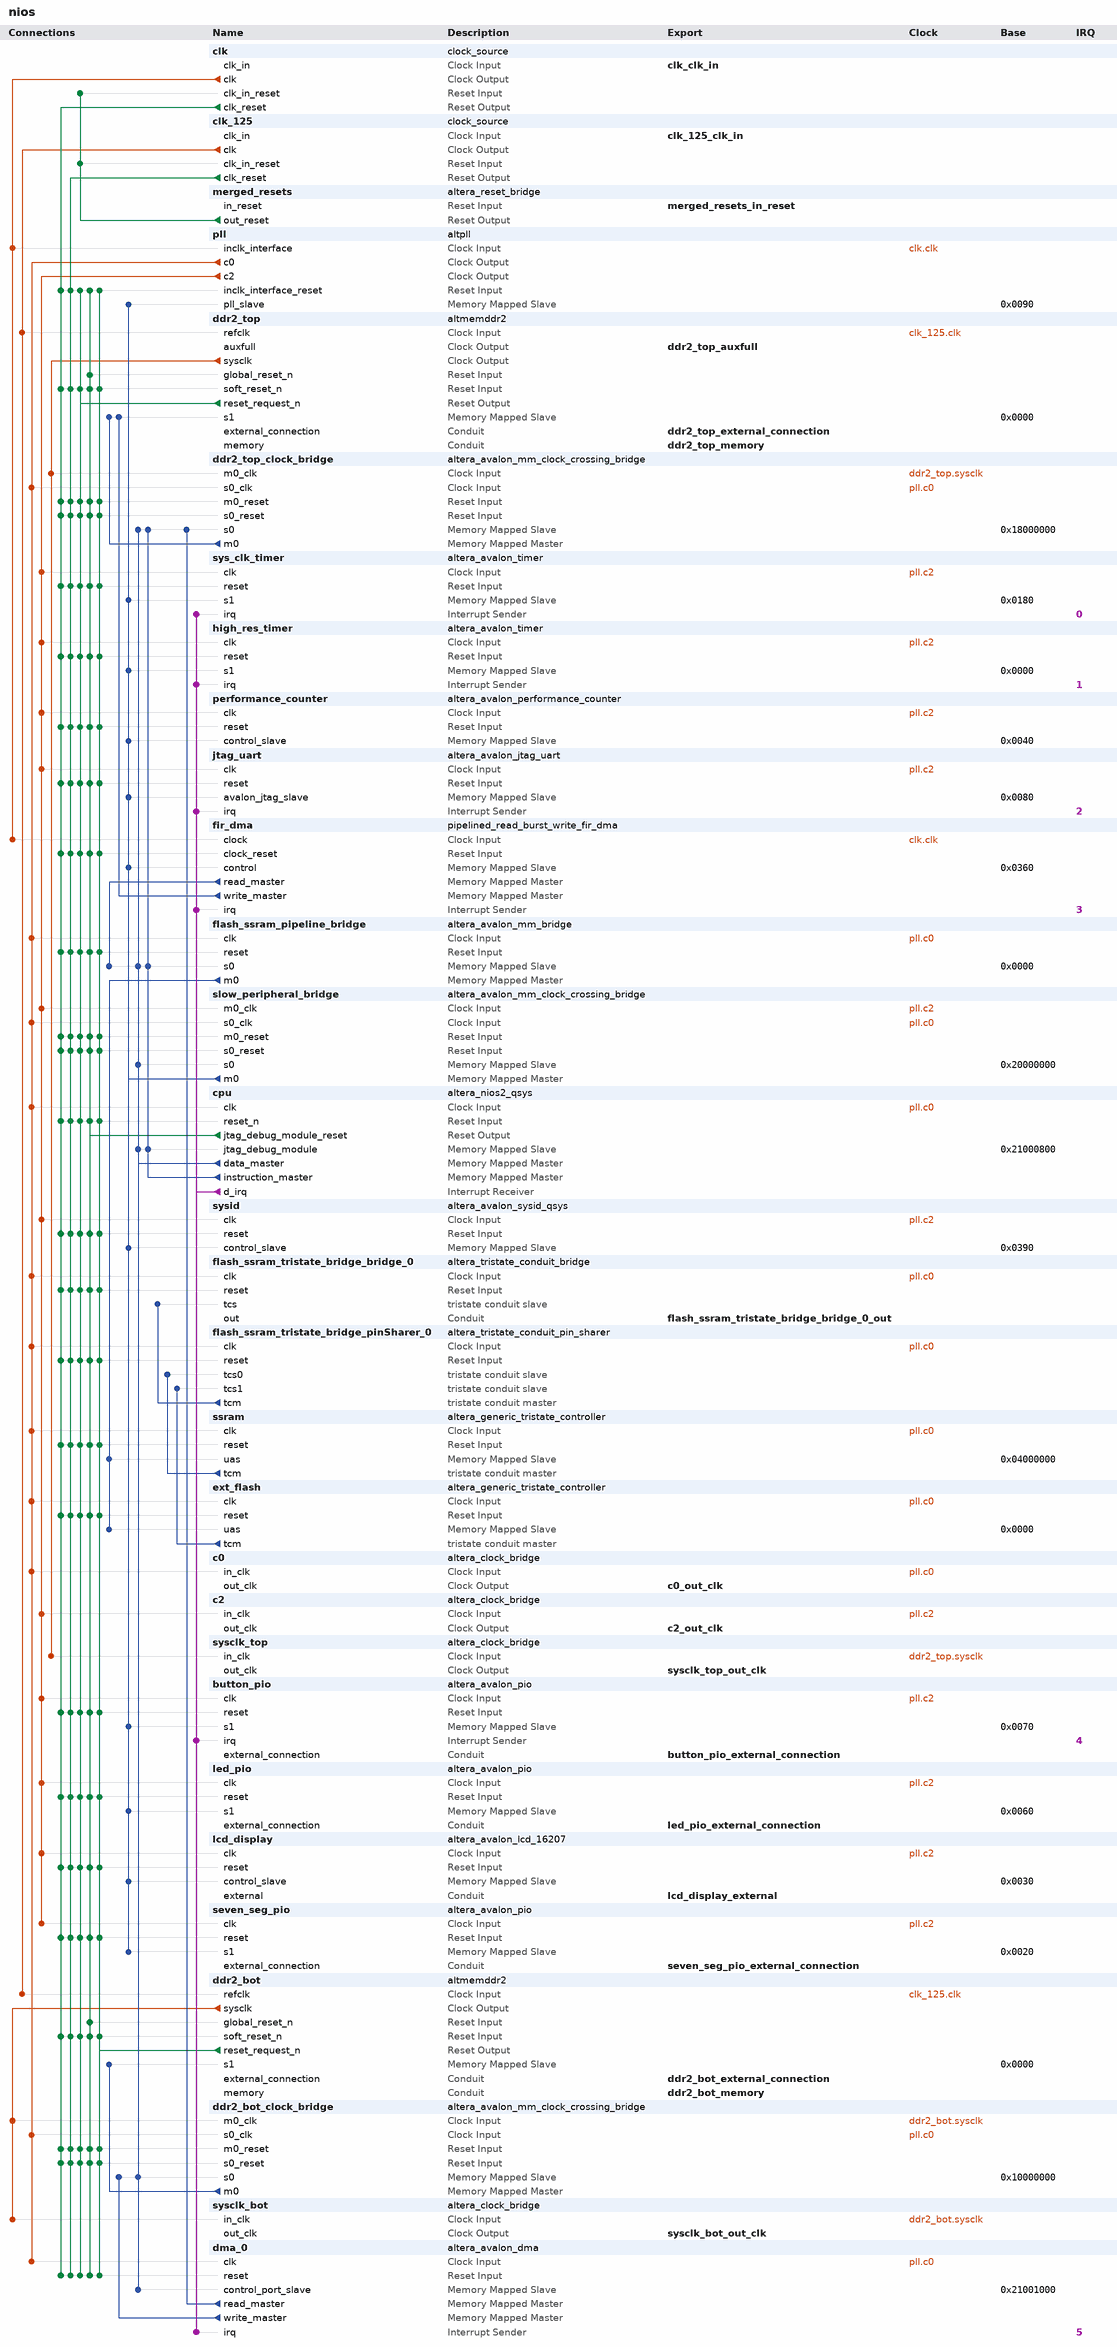
[diagram p0: system contents]
# Platform Designer (Qsys) system nios, Cyclone III EP3C120F780C7
# Parameters at their usual value, and those the tool derives, are not listed.
package require -exact qsys 13.0
create_system nios
set_project_property DEVICE_FAMILY {Cyclone III}
set_project_property DEVICE EP3C120F780C7

add_instance clk clock_source 13.0
set_instance_parameter_value clk clockFrequency 50000000

add_instance clk_125 clock_source 13.0
set_instance_parameter_value clk_125 clockFrequency 125000000

add_instance merged_resets altera_reset_bridge 13.0
set_instance_parameter_value merged_resets ACTIVE_LOW_RESET 1
set_instance_parameter_value merged_resets SYNCHRONOUS_EDGES none

add_instance pll altpll 13.0
set_instance_parameter_value pll INCLK0_INPUT_FREQUENCY 20000
set_instance_parameter_value pll CLK0_MULTIPLY_BY 2
set_instance_parameter_value pll CLK2_MULTIPLY_BY 6
set_instance_parameter_value pll CLK0_DIVIDE_BY 1
set_instance_parameter_value pll CLK2_DIVIDE_BY 5
set_instance_parameter_value pll CLK2_PHASE_SHIFT 0
set_instance_parameter_value pll CLK2_DUTY_CYCLE 50
set_instance_parameter_value pll PORT_clk1 PORT_UNUSED
set_instance_parameter_value pll PORT_clk2 PORT_USED
set_instance_parameter_value pll PORT_clk3 PORT_UNUSED
set_instance_parameter_value pll PORT_ARESET PORT_UNUSED
set_instance_parameter_value pll PORT_LOCKED PORT_UNUSED

add_instance ddr2_top altmemddr2 13.0
set_instance_parameter_value ddr2_top pipeline_commands false
set_instance_parameter_value ddr2_top debug_en false
set_instance_parameter_value ddr2_top export_debug_port false
set_instance_parameter_value ddr2_top use_generated_memory_model true
set_instance_parameter_value ddr2_top dedicated_memory_clk_phase_label {Dedicated memory clock phase:}
set_instance_parameter_value ddr2_top mem_if_clk_mhz 153.85
set_instance_parameter_value ddr2_top quartus_project_exists false
set_instance_parameter_value ddr2_top local_if_drate Full
set_instance_parameter_value ddr2_top enable_v72_rsu false
set_instance_parameter_value ddr2_top local_if_clk_mhz_label 153.9
set_instance_parameter_value ddr2_top new_variant true
set_instance_parameter_value ddr2_top mem_if_memtype {DDR2 SDRAM}
set_instance_parameter_value ddr2_top pll_ref_clk_mhz 125.0
set_instance_parameter_value ddr2_top mem_if_clk_ps_label {(6500 ps)}
set_instance_parameter_value ddr2_top family {Cyclone III}
set_instance_parameter_value ddr2_top project_family {Cyclone III}
set_instance_parameter_value ddr2_top speed_grade 7
set_instance_parameter_value ddr2_top dedicated_memory_clk_phase 0
set_instance_parameter_value ddr2_top pll_ref_clk_ps_label {(8000 ps)}
set_instance_parameter_value ddr2_top avalon_burst_length 1
set_instance_parameter_value ddr2_top mem_if_clk_pair_count 1
set_instance_parameter_value ddr2_top mem_if_cs_per_dimm 1
set_instance_parameter_value ddr2_top pre_latency_label {Fix read latency at:}
set_instance_parameter_value ddr2_top dedicated_memory_clk_en false
set_instance_parameter_value ddr2_top mirror_addressing 0
set_instance_parameter_value ddr2_top mem_if_bankaddr_width 2
set_instance_parameter_value ddr2_top register_control_word_9 0000
set_instance_parameter_value ddr2_top mem_if_rowaddr_width 13
set_instance_parameter_value ddr2_top mem_dyn_deskew_en false
set_instance_parameter_value ddr2_top post_latency_label {cycles (0 cycles=minimum latency, non-deterministic)}
set_instance_parameter_value ddr2_top mem_if_dm_pins_en Yes
set_instance_parameter_value ddr2_top local_if_dwidth_label 64
set_instance_parameter_value ddr2_top register_control_word_7 0000
set_instance_parameter_value ddr2_top register_control_word_8 0000
set_instance_parameter_value ddr2_top mem_if_preset {Micron MT47H32M16CC-3x2}
set_instance_parameter_value ddr2_top mem_if_pchaddr_bit 10
set_instance_parameter_value ddr2_top WIDTH_RATIO 4
set_instance_parameter_value ddr2_top vendor Micron
set_instance_parameter_value ddr2_top register_control_word_3 0000
set_instance_parameter_value ddr2_top register_control_word_4 0000
set_instance_parameter_value ddr2_top chip_or_dimm {Discrete Device}
set_instance_parameter_value ddr2_top register_control_word_5 0000
set_instance_parameter_value ddr2_top register_control_word_6 0000
set_instance_parameter_value ddr2_top mem_fmax 333.333
set_instance_parameter_value ddr2_top register_control_word_0 0000
set_instance_parameter_value ddr2_top register_control_word_size 4
set_instance_parameter_value ddr2_top register_control_word_1 0000
set_instance_parameter_value ddr2_top register_control_word_2 0000
set_instance_parameter_value ddr2_top register_control_word_11 0000
set_instance_parameter_value ddr2_top register_control_word_10 0000
set_instance_parameter_value ddr2_top mem_if_cs_width 1
set_instance_parameter_value ddr2_top mem_if_preset_rlat 0
set_instance_parameter_value ddr2_top mem_if_cs_per_rank 1
set_instance_parameter_value ddr2_top fast_simulation_en FAST
set_instance_parameter_value ddr2_top register_control_word_15 0000
set_instance_parameter_value ddr2_top register_control_word_14 0000
set_instance_parameter_value ddr2_top mem_if_dwidth 32
set_instance_parameter_value ddr2_top mem_if_dq_per_dqs 8
set_instance_parameter_value ddr2_top mem_if_coladdr_width 10
set_instance_parameter_value ddr2_top register_control_word_13 0000
set_instance_parameter_value ddr2_top register_control_word_12 0000
set_instance_parameter_value ddr2_top mem_tiha_ps 400
set_instance_parameter_value ddr2_top mem_tdsh_ck 0.2
set_instance_parameter_value ddr2_top mem_if_trfc_ns 105.0
set_instance_parameter_value ddr2_top mem_tqh_ck 0.36
set_instance_parameter_value ddr2_top mem_tisa_ps 400
set_instance_parameter_value ddr2_top mem_tdss_ck 0.2
set_instance_parameter_value ddr2_top mem_trtp_ns 7.5
set_instance_parameter_value ddr2_top mem_if_tinit_us 200.0
set_instance_parameter_value ddr2_top mem_if_trcd_ns 15.0
set_instance_parameter_value ddr2_top mem_if_twtr_ck 3
set_instance_parameter_value ddr2_top mem_trrd_ns 10.0
set_instance_parameter_value ddr2_top mem_tdqss_ck 0.25
set_instance_parameter_value ddr2_top mem_tqhs_ps 340
set_instance_parameter_value ddr2_top mem_tdsa_ps 300
set_instance_parameter_value ddr2_top mem_tac_ps 450
set_instance_parameter_value ddr2_top mem_tdha_ps 300
set_instance_parameter_value ddr2_top mem_if_tras_ns 40.0
set_instance_parameter_value ddr2_top mem_if_twr_ns 15.0
set_instance_parameter_value ddr2_top mem_tdqsck_ps 400
set_instance_parameter_value ddr2_top mem_if_trp_ns 15.0
set_instance_parameter_value ddr2_top mem_tdqsq_ps 240
set_instance_parameter_value ddr2_top mem_if_tmrd_ns 6.0
set_instance_parameter_value ddr2_top mem_tfaw_ns 50.0
set_instance_parameter_value ddr2_top mem_if_trefi_us 7.8
set_instance_parameter_value ddr2_top mem_tcl_40_fmax 266.667
set_instance_parameter_value ddr2_top mem_odt 50
set_instance_parameter_value ddr2_top mp_WLH_percent 0.6
set_instance_parameter_value ddr2_top mem_drv_str Normal
set_instance_parameter_value ddr2_top mp_DH_percent 0.5
set_instance_parameter_value ddr2_top input_period 0
set_instance_parameter_value ddr2_top mp_QH_percent 0.5
set_instance_parameter_value ddr2_top mp_QHS_percent 0.5
set_instance_parameter_value ddr2_top mem_tcl_30_fmax 200.0
set_instance_parameter_value ddr2_top ac_clk_select 90
set_instance_parameter_value ddr2_top mp_DQSQ_percent 0.65
set_instance_parameter_value ddr2_top mp_DS_percent 0.6
set_instance_parameter_value ddr2_top pll_reconfig_ports_en false
set_instance_parameter_value ddr2_top mem_btype Sequential
set_instance_parameter_value ddr2_top mp_IS_percent 0.7
set_instance_parameter_value ddr2_top mem_tcl 5.0
set_instance_parameter_value ddr2_top mp_DQSS_percent 0.5
set_instance_parameter_value ddr2_top export_bank_info false
set_instance_parameter_value ddr2_top mp_DSS_percent 0.6
set_instance_parameter_value ddr2_top mem_dll_en Yes
set_instance_parameter_value ddr2_top ac_phase 90
set_instance_parameter_value ddr2_top mem_if_oct_en false
set_instance_parameter_value ddr2_top mem_tcl_60_fmax 333.333
set_instance_parameter_value ddr2_top mp_DSH_percent 0.6
set_instance_parameter_value ddr2_top mem_if_dqsn_en false
set_instance_parameter_value ddr2_top enable_mp_calibration true
set_instance_parameter_value ddr2_top mp_IH_percent 0.6
set_instance_parameter_value ddr2_top mem_tcl_15_fmax 533.0
set_instance_parameter_value ddr2_top dll_external false
set_instance_parameter_value ddr2_top mem_bl 4
set_instance_parameter_value ddr2_top mp_WLS_percent 0.7
set_instance_parameter_value ddr2_top mem_tcl_50_fmax 333.333
set_instance_parameter_value ddr2_top mp_DQSCK_percent 0.5
set_instance_parameter_value ddr2_top mem_tcl_25_fmax 533.0
set_instance_parameter_value ddr2_top mem_tcl_20_fmax 533.0
set_instance_parameter_value ddr2_top cfg_reorder_data true
set_instance_parameter_value ddr2_top ctl_ecc_en false
set_instance_parameter_value ddr2_top ctl_hrb_en false
set_instance_parameter_value ddr2_top ref_clk_source clk_125
set_instance_parameter_value ddr2_top cfg_data_reordering_type INTER_BANK
set_instance_parameter_value ddr2_top ctl_powerdn_en false
set_instance_parameter_value ddr2_top multicast_wr_en false
set_instance_parameter_value ddr2_top auto_powerdn_cycles 0
set_instance_parameter_value ddr2_top ctl_self_refresh_en false
set_instance_parameter_value ddr2_top cfg_starve_limit 10
set_instance_parameter_value ddr2_top ctl_latency 0
set_instance_parameter_value ddr2_top tool_context SOPC_BUILDER
set_instance_parameter_value ddr2_top mem_addr_mapping CHIP_ROW_BANK_COL
set_instance_parameter_value ddr2_top burst_merge_en false
set_instance_parameter_value ddr2_top user_refresh_en false
set_instance_parameter_value ddr2_top qsys_mode true
set_instance_parameter_value ddr2_top clk_source_sharing_en false
set_instance_parameter_value ddr2_top ctl_lookahead_depth 4
set_instance_parameter_value ddr2_top ctl_autopch_en false
set_instance_parameter_value ddr2_top ctl_dynamic_bank_allocation false
set_instance_parameter_value ddr2_top ctl_dynamic_bank_num 4
set_instance_parameter_value ddr2_top local_if_type_avalon true
set_instance_parameter_value ddr2_top csr_en false
set_instance_parameter_value ddr2_top ctl_auto_correct_en false
set_instance_parameter_value ddr2_top auto_powerdn_en false
set_instance_parameter_value ddr2_top phy_if_type_afi true
set_instance_parameter_value ddr2_top controller_type ngv110_ctl
set_instance_parameter_value ddr2_top max_local_size 4
set_instance_parameter_value ddr2_top mem_srtr Normal
set_instance_parameter_value ddr2_top mem_mpr_loc {Predefined Pattern}
set_instance_parameter_value ddr2_top dss_tinit_rst_us 200.0
set_instance_parameter_value ddr2_top mem_tcl_90_fmax 400.0
set_instance_parameter_value ddr2_top mem_rtt_wr {Dynamic ODT off}
set_instance_parameter_value ddr2_top mem_tcl_100_fmax 400.0
set_instance_parameter_value ddr2_top mem_pasr {Full Array}
set_instance_parameter_value ddr2_top mem_asrm {Manual SR Reference (SRT)}
set_instance_parameter_value ddr2_top mem_mpr_oper {Predefined Pattern}
set_instance_parameter_value ddr2_top mem_tcl_80_fmax 400.0
set_instance_parameter_value ddr2_top mem_drv_impedance RZQ/7
set_instance_parameter_value ddr2_top mem_rtt_nom {ODT Disabled}
set_instance_parameter_value ddr2_top mem_tcl_70_fmax 400.0
set_instance_parameter_value ddr2_top mem_wtcl 5.0
set_instance_parameter_value ddr2_top mem_dll_pch {Fast Exit}
set_instance_parameter_value ddr2_top mem_atcl Disabled
set_instance_parameter_value ddr2_top board_settings_valid true
set_instance_parameter_value ddr2_top t_IH 0.4
set_instance_parameter_value ddr2_top board_intra_DQS_group_skew 0.02
set_instance_parameter_value ddr2_top isi_DQS 0.0
set_instance_parameter_value ddr2_top addr_cmd_slew_rate 1.0
set_instance_parameter_value ddr2_top board_tpd_inter_DIMM 0.05
set_instance_parameter_value ddr2_top board_addresscmd_CK_skew 0.0
set_instance_parameter_value ddr2_top t_DS_calculated 0.300
set_instance_parameter_value ddr2_top isi_addresscmd_hold 0.0
set_instance_parameter_value ddr2_top t_IS 0.4
set_instance_parameter_value ddr2_top restore_default_toggle false
set_instance_parameter_value ddr2_top dqs_dqsn_slew_rate 2.0
set_instance_parameter_value ddr2_top dq_slew_rate 1.0
set_instance_parameter_value ddr2_top board_inter_DQS_group_skew 0.02
set_instance_parameter_value ddr2_top isi_addresscmd_setup 0.0
set_instance_parameter_value ddr2_top board_minCK_DQS_skew -0.01
set_instance_parameter_value ddr2_top t_IS_calculated 0.400
set_instance_parameter_value ddr2_top num_slots_or_devices 1
set_instance_parameter_value ddr2_top board_maxCK_DQS_skew 0.01
set_instance_parameter_value ddr2_top board_skew_ps 20
set_instance_parameter_value ddr2_top t_DH 0.3
set_instance_parameter_value ddr2_top ck_ckn_slew_rate 2.0
set_instance_parameter_value ddr2_top isi_DQ 0.0
set_instance_parameter_value ddr2_top t_IH_calculated 0.400
set_instance_parameter_value ddr2_top t_DH_calculated 0.300
set_instance_parameter_value ddr2_top t_DS 0.3

add_instance ddr2_top_clock_bridge altera_avalon_mm_clock_crossing_bridge 13.0
set_instance_parameter_value ddr2_top_clock_bridge DATA_WIDTH 64
set_instance_parameter_value ddr2_top_clock_bridge ADDRESS_WIDTH 27
set_instance_parameter_value ddr2_top_clock_bridge MAX_BURST_SIZE 1
set_instance_parameter_value ddr2_top_clock_bridge COMMAND_FIFO_DEPTH 8
set_instance_parameter_value ddr2_top_clock_bridge RESPONSE_FIFO_DEPTH 64
set_instance_parameter_value ddr2_top_clock_bridge MASTER_SYNC_DEPTH 3
set_instance_parameter_value ddr2_top_clock_bridge SLAVE_SYNC_DEPTH 3

add_instance sys_clk_timer altera_avalon_timer 13.0.1
set_instance_parameter_value sys_clk_timer period 10.0
set_instance_parameter_value sys_clk_timer periodUnits MSEC

add_instance high_res_timer altera_avalon_timer 13.0.1
set_instance_parameter_value high_res_timer period 10.0
set_instance_parameter_value high_res_timer periodUnits USEC

add_instance performance_counter altera_avalon_performance_counter 13.0.1
set_instance_parameter_value performance_counter numberOfSections 1

add_instance jtag_uart altera_avalon_jtag_uart 13.0.1
set_instance_parameter_value jtag_uart readBufferDepth 8
set_instance_parameter_value jtag_uart readIRQThreshold 4
set_instance_parameter_value jtag_uart simInteractiveOptions INTERACTIVE_ASCII_OUTPUT
set_instance_parameter_value jtag_uart useRegistersForReadBuffer true
set_instance_parameter_value jtag_uart useRegistersForWriteBuffer true
set_instance_parameter_value jtag_uart writeBufferDepth 8
set_instance_parameter_value jtag_uart writeIRQThreshold 4

add_instance fir_dma pipelined_read_burst_write_fir_dma 1.0
set_instance_parameter_value fir_dma DATAWIDTH 32
set_instance_parameter_value fir_dma BYTEENABLEWIDTH 4
set_instance_parameter_value fir_dma ADDRESSWIDTH 32
set_instance_parameter_value fir_dma FIFOUSEMEMORY 1
set_instance_parameter_value fir_dma READ_FIFODEPTH 32
set_instance_parameter_value fir_dma READ_FIFODEPTH_LOG2 5
set_instance_parameter_value fir_dma WRITE_FIFODEPTH 32
set_instance_parameter_value fir_dma WRITE_FIFODEPTH_LOG2 5
set_instance_parameter_value fir_dma WRITE_MAXBURSTCOUNT 4
set_instance_parameter_value fir_dma WRITE_MAXBURSTCOUNT_WIDTH 3

add_instance flash_ssram_pipeline_bridge altera_avalon_mm_bridge 13.0
set_instance_parameter_value flash_ssram_pipeline_bridge DATA_WIDTH 32
set_instance_parameter_value flash_ssram_pipeline_bridge ADDRESS_WIDTH 27
set_instance_parameter_value flash_ssram_pipeline_bridge ADDRESS_UNITS SYMBOLS
set_instance_parameter_value flash_ssram_pipeline_bridge MAX_PENDING_RESPONSES 7

add_instance slow_peripheral_bridge altera_avalon_mm_clock_crossing_bridge 13.0
set_instance_parameter_value slow_peripheral_bridge DATA_WIDTH 32
set_instance_parameter_value slow_peripheral_bridge ADDRESS_WIDTH 10
set_instance_parameter_value slow_peripheral_bridge MAX_BURST_SIZE 1
set_instance_parameter_value slow_peripheral_bridge COMMAND_FIFO_DEPTH 16
set_instance_parameter_value slow_peripheral_bridge RESPONSE_FIFO_DEPTH 64
set_instance_parameter_value slow_peripheral_bridge MASTER_SYNC_DEPTH 3
set_instance_parameter_value slow_peripheral_bridge SLAVE_SYNC_DEPTH 3

add_instance cpu altera_nios2_qsys 13.0
set_instance_parameter_value cpu cpuID 1
set_instance_parameter_value cpu resetSlave ddr2_top.s1
set_instance_parameter_value cpu mmu_TLBMissExcSlave None
set_instance_parameter_value cpu exceptionSlave ddr2_top.s1
set_instance_parameter_value cpu breakSlave cpu.jtag_debug_module
set_instance_parameter_value cpu impl Fast
set_instance_parameter_value cpu icache_size 32768
set_instance_parameter_value cpu dcache_size 32768

add_instance sysid altera_avalon_sysid_qsys 13.0
set_instance_parameter_value sysid id 2

add_instance flash_ssram_tristate_bridge_bridge_0 altera_tristate_conduit_bridge 13.0

add_instance flash_ssram_tristate_bridge_pinSharer_0 altera_tristate_conduit_pin_sharer 13.0
set_instance_parameter_value flash_ssram_tristate_bridge_pinSharer_0 NUM_INTERFACES 2
set_instance_parameter_value flash_ssram_tristate_bridge_pinSharer_0 MODULE_ORIGIN_LIST ext_flash.tcm,ext_flash.tcm,ext_flash.tcm,ext_flash.tcm,ext_flash.tcm,ssram.tcm,ssram.tcm,ssram.tcm,ssram.tcm,ssram.tcm,ssram.tcm
set_instance_parameter_value flash_ssram_tristate_bridge_pinSharer_0 SIGNAL_ORIGIN_LIST address,read_n,write_n,data,chipselect_n,address,byteenable_n,read_n,write_n,data,chipselect_n
set_instance_parameter_value flash_ssram_tristate_bridge_pinSharer_0 SHARED_SIGNAL_LIST flash_ssram_tristate_bridge_address,read_n_to_the_ext_flash,write_n_to_the_ext_flash,flash_ssram_tristate_bridge_data,select_n_to_the_ext_flash,address_to_the_ssram,bw_n_to_the_ssram,,bwe_n_to_the_ssram,flash_ssram_tristate_bridge_data,chipenable1_n_to_the_ssram

add_instance ssram altera_generic_tristate_controller 13.0
set_instance_parameter_value ssram TCM_ADDRESS_W 23
set_instance_parameter_value ssram TCM_DATA_W 32
set_instance_parameter_value ssram TCM_BYTEENABLE_W 4
set_instance_parameter_value ssram TCM_READ_WAIT 200
set_instance_parameter_value ssram TCM_WRITE_WAIT 200
set_instance_parameter_value ssram TCM_SETUP_WAIT 200
set_instance_parameter_value ssram TCM_DATA_HOLD 200
set_instance_parameter_value ssram TCM_MAX_PENDING_READ_TRANSACTIONS 5
set_instance_parameter_value ssram TCM_TURNAROUND_TIME 2
set_instance_parameter_value ssram TCM_TIMING_UNITS 0
set_instance_parameter_value ssram TCM_READLATENCY 4
set_instance_parameter_value ssram TCM_SYMBOLS_PER_WORD 4
set_instance_parameter_value ssram USE_READ 1
set_instance_parameter_value ssram USE_BEGINTRANSFER 0
set_instance_parameter_value ssram USE_BYTEENABLE 1
set_instance_parameter_value ssram USE_OUTPUTENABLE 0
set_instance_parameter_value ssram ACTIVE_LOW_READ 1
set_instance_parameter_value ssram ACTIVE_LOW_BYTEENABLE 1
set_instance_parameter_value ssram ACTIVE_LOW_OUTPUTENABLE 0
set_instance_parameter_value ssram ACTIVE_LOW_BEGINTRANSFER 0
set_instance_parameter_value ssram CHIPSELECT_THROUGH_READLATENCY 0
set_instance_parameter_value ssram MODULE_ASSIGNMENT_KEYS embeddedsw.configuration.hwClassnameDriverSupportList,embeddedsw.CMacro.SRAM_MEMORY_SIZE,embeddedsw.CMacro.SRAM_MEMORY_UNITS,embeddedsw.CMacro.SSRAM_DATA_WIDTH,embeddedsw.CMacro.SSRAM_READ_LATENCY,embeddedsw.memoryInfo.MEM_INIT_DATA_WIDTH,embeddedsw.memoryInfo.HAS_BYTE_LANE,embeddedsw.memoryInfo.GENERATE_DAT_SYM,embeddedsw.memoryInfo.DAT_SYM_INSTALL_DIR
set_instance_parameter_value ssram MODULE_ASSIGNMENT_VALUES altera_avalon_lan91c111:altera_avalon_cfi_flash,1,1048576,32,2,32,1,1,SIM_DIR
set_instance_parameter_value ssram INTERFACE_ASSIGNMENT_KEYS embeddedsw.configuration.isMemoryDevice
set_instance_parameter_value ssram INTERFACE_ASSIGNMENT_VALUES 1

add_instance ext_flash altera_generic_tristate_controller 13.0
set_instance_parameter_value ext_flash TCM_ADDRESS_W 26
set_instance_parameter_value ext_flash TCM_DATA_W 16
set_instance_parameter_value ext_flash TCM_BYTEENABLE_W 2
set_instance_parameter_value ext_flash TCM_READ_WAIT 40
set_instance_parameter_value ext_flash TCM_WRITE_WAIT 40
set_instance_parameter_value ext_flash TCM_SETUP_WAIT 80
set_instance_parameter_value ext_flash TCM_DATA_HOLD 20
set_instance_parameter_value ext_flash TCM_MAX_PENDING_READ_TRANSACTIONS 3
set_instance_parameter_value ext_flash TCM_TURNAROUND_TIME 2
set_instance_parameter_value ext_flash TCM_TIMING_UNITS 0
set_instance_parameter_value ext_flash TCM_READLATENCY 2
set_instance_parameter_value ext_flash TCM_SYMBOLS_PER_WORD 2
set_instance_parameter_value ext_flash USE_READ 1
set_instance_parameter_value ext_flash USE_BEGINTRANSFER 0
set_instance_parameter_value ext_flash USE_BYTEENABLE 0
set_instance_parameter_value ext_flash USE_OUTPUTENABLE 0
set_instance_parameter_value ext_flash ACTIVE_LOW_READ 1
set_instance_parameter_value ext_flash ACTIVE_LOW_BYTEENABLE 0
set_instance_parameter_value ext_flash ACTIVE_LOW_OUTPUTENABLE 0
set_instance_parameter_value ext_flash ACTIVE_LOW_BEGINTRANSFER 0
set_instance_parameter_value ext_flash CHIPSELECT_THROUGH_READLATENCY 0
set_instance_parameter_value ext_flash MODULE_ASSIGNMENT_KEYS embeddedsw.configuration.hwClassnameDriverSupportList,embeddedsw.configuration.hwClassnameDriverSupportDefault,embeddedsw.CMacro.SETUP_VALUE,embeddedsw.CMacro.WAIT_VALUE,embeddedsw.CMacro.HOLD_VALUE,embeddedsw.CMacro.TIMING_UNITS,embeddedsw.CMacro.SIZE,embeddedsw.memoryInfo.MEM_INIT_DATA_WIDTH,embeddedsw.memoryInfo.HAS_BYTE_LANE,embeddedsw.memoryInfo.IS_FLASH,embeddedsw.memoryInfo.GENERATE_DAT_SYM,embeddedsw.memoryInfo.GENERATE_FLASH,embeddedsw.memoryInfo.DAT_SYM_INSTALL_DIR,embeddedsw.memoryInfo.FLASH_INSTALL_DIR
set_instance_parameter_value ext_flash MODULE_ASSIGNMENT_VALUES {altera_avalon_lan91c111:altera_avalon_cfi_flash,altera_avalon_cfi_flash,80,40,20,"ns",67108864u,16,1,1,1,1,SIM_DIR,APP_DIR}
set_instance_parameter_value ext_flash INTERFACE_ASSIGNMENT_KEYS embeddedsw.configuration.isFlash,embeddedsw.configuration.isMemoryDevice,embeddedsw.configuration.isNonVolatileStorage
set_instance_parameter_value ext_flash INTERFACE_ASSIGNMENT_VALUES 1,1,1

add_instance c0 altera_clock_bridge 13.0
set_instance_parameter_value c0 DERIVED_CLOCK_RATE 100000000
set_instance_parameter_value c0 EXPLICIT_CLOCK_RATE 0

add_instance c2 altera_clock_bridge 13.0
set_instance_parameter_value c2 DERIVED_CLOCK_RATE 60000000
set_instance_parameter_value c2 EXPLICIT_CLOCK_RATE 0

add_instance sysclk_top altera_clock_bridge 13.0
set_instance_parameter_value sysclk_top DERIVED_CLOCK_RATE 153850000
set_instance_parameter_value sysclk_top EXPLICIT_CLOCK_RATE 0

add_instance button_pio altera_avalon_pio 13.0.1
set_instance_parameter_value button_pio captureEdge true
set_instance_parameter_value button_pio direction Input
set_instance_parameter_value button_pio generateIRQ true
set_instance_parameter_value button_pio irqType EDGE
set_instance_parameter_value button_pio simDoTestBenchWiring true
set_instance_parameter_value button_pio simDrivenValue 15
set_instance_parameter_value button_pio width 4

add_instance led_pio altera_avalon_pio 13.0.1
set_instance_parameter_value led_pio direction Output
set_instance_parameter_value led_pio width 8

add_instance lcd_display altera_avalon_lcd_16207 13.0.1

add_instance seven_seg_pio altera_avalon_pio 13.0.1
set_instance_parameter_value seven_seg_pio direction Output
set_instance_parameter_value seven_seg_pio width 16

add_instance ddr2_bot altmemddr2 13.0
set_instance_parameter_value ddr2_bot pipeline_commands false
set_instance_parameter_value ddr2_bot debug_en false
set_instance_parameter_value ddr2_bot export_debug_port false
set_instance_parameter_value ddr2_bot use_generated_memory_model true
set_instance_parameter_value ddr2_bot dedicated_memory_clk_phase_label {Dedicated memory clock phase:}
set_instance_parameter_value ddr2_bot mem_if_clk_mhz 153.85
set_instance_parameter_value ddr2_bot quartus_project_exists false
set_instance_parameter_value ddr2_bot local_if_drate Full
set_instance_parameter_value ddr2_bot enable_v72_rsu false
set_instance_parameter_value ddr2_bot local_if_clk_mhz_label 153.9
set_instance_parameter_value ddr2_bot new_variant true
set_instance_parameter_value ddr2_bot mem_if_memtype {DDR2 SDRAM}
set_instance_parameter_value ddr2_bot pll_ref_clk_mhz 125.0
set_instance_parameter_value ddr2_bot mem_if_clk_ps_label {(6500 ps)}
set_instance_parameter_value ddr2_bot family {Cyclone III}
set_instance_parameter_value ddr2_bot project_family {Cyclone III}
set_instance_parameter_value ddr2_bot speed_grade 7
set_instance_parameter_value ddr2_bot dedicated_memory_clk_phase 0
set_instance_parameter_value ddr2_bot pll_ref_clk_ps_label {(8000 ps)}
set_instance_parameter_value ddr2_bot avalon_burst_length 1
set_instance_parameter_value ddr2_bot mem_if_clk_pair_count 1
set_instance_parameter_value ddr2_bot mem_if_cs_per_dimm 1
set_instance_parameter_value ddr2_bot pre_latency_label {Fix read latency at:}
set_instance_parameter_value ddr2_bot dedicated_memory_clk_en false
set_instance_parameter_value ddr2_bot mirror_addressing 0
set_instance_parameter_value ddr2_bot mem_if_bankaddr_width 2
set_instance_parameter_value ddr2_bot register_control_word_9 0000
set_instance_parameter_value ddr2_bot mem_if_rowaddr_width 13
set_instance_parameter_value ddr2_bot mem_dyn_deskew_en false
set_instance_parameter_value ddr2_bot post_latency_label {cycles (0 cycles=minimum latency, non-deterministic)}
set_instance_parameter_value ddr2_bot mem_if_dm_pins_en Yes
set_instance_parameter_value ddr2_bot local_if_dwidth_label 64
set_instance_parameter_value ddr2_bot register_control_word_7 0000
set_instance_parameter_value ddr2_bot register_control_word_8 0000
set_instance_parameter_value ddr2_bot mem_if_preset {Micron MT47H32M16CC-3x2}
set_instance_parameter_value ddr2_bot mem_if_pchaddr_bit 10
set_instance_parameter_value ddr2_bot WIDTH_RATIO 4
set_instance_parameter_value ddr2_bot vendor Micron
set_instance_parameter_value ddr2_bot register_control_word_3 0000
set_instance_parameter_value ddr2_bot register_control_word_4 0000
set_instance_parameter_value ddr2_bot chip_or_dimm {Discrete Device}
set_instance_parameter_value ddr2_bot register_control_word_5 0000
set_instance_parameter_value ddr2_bot register_control_word_6 0000
set_instance_parameter_value ddr2_bot mem_fmax 333.333
set_instance_parameter_value ddr2_bot register_control_word_0 0000
set_instance_parameter_value ddr2_bot register_control_word_size 4
set_instance_parameter_value ddr2_bot register_control_word_1 0000
set_instance_parameter_value ddr2_bot register_control_word_2 0000
set_instance_parameter_value ddr2_bot register_control_word_11 0000
set_instance_parameter_value ddr2_bot register_control_word_10 0000
set_instance_parameter_value ddr2_bot mem_if_cs_width 1
set_instance_parameter_value ddr2_bot mem_if_preset_rlat 0
set_instance_parameter_value ddr2_bot mem_if_cs_per_rank 1
set_instance_parameter_value ddr2_bot fast_simulation_en FAST
set_instance_parameter_value ddr2_bot register_control_word_15 0000
set_instance_parameter_value ddr2_bot register_control_word_14 0000
set_instance_parameter_value ddr2_bot mem_if_dwidth 32
set_instance_parameter_value ddr2_bot mem_if_dq_per_dqs 8
set_instance_parameter_value ddr2_bot mem_if_coladdr_width 10
set_instance_parameter_value ddr2_bot register_control_word_13 0000
set_instance_parameter_value ddr2_bot register_control_word_12 0000
set_instance_parameter_value ddr2_bot mem_tiha_ps 400
set_instance_parameter_value ddr2_bot mem_tdsh_ck 0.2
set_instance_parameter_value ddr2_bot mem_if_trfc_ns 105.0
set_instance_parameter_value ddr2_bot mem_tqh_ck 0.36
set_instance_parameter_value ddr2_bot mem_tisa_ps 400
set_instance_parameter_value ddr2_bot mem_tdss_ck 0.2
set_instance_parameter_value ddr2_bot mem_trtp_ns 7.5
set_instance_parameter_value ddr2_bot mem_if_tinit_us 200.0
set_instance_parameter_value ddr2_bot mem_if_trcd_ns 15.0
set_instance_parameter_value ddr2_bot mem_if_twtr_ck 3
set_instance_parameter_value ddr2_bot mem_trrd_ns 10.0
set_instance_parameter_value ddr2_bot mem_tdqss_ck 0.25
set_instance_parameter_value ddr2_bot mem_tqhs_ps 340
set_instance_parameter_value ddr2_bot mem_tdsa_ps 300
set_instance_parameter_value ddr2_bot mem_tac_ps 450
set_instance_parameter_value ddr2_bot mem_tdha_ps 300
set_instance_parameter_value ddr2_bot mem_if_tras_ns 40.0
set_instance_parameter_value ddr2_bot mem_if_twr_ns 15.0
set_instance_parameter_value ddr2_bot mem_tdqsck_ps 400
set_instance_parameter_value ddr2_bot mem_if_trp_ns 15.0
set_instance_parameter_value ddr2_bot mem_tdqsq_ps 240
set_instance_parameter_value ddr2_bot mem_if_tmrd_ns 6.0
set_instance_parameter_value ddr2_bot mem_tfaw_ns 50.0
set_instance_parameter_value ddr2_bot mem_if_trefi_us 7.8
set_instance_parameter_value ddr2_bot mem_tcl_40_fmax 266.667
set_instance_parameter_value ddr2_bot mem_odt 50
set_instance_parameter_value ddr2_bot mp_WLH_percent 0.6
set_instance_parameter_value ddr2_bot mem_drv_str Normal
set_instance_parameter_value ddr2_bot mp_DH_percent 0.5
set_instance_parameter_value ddr2_bot input_period 0
set_instance_parameter_value ddr2_bot mp_QH_percent 0.5
set_instance_parameter_value ddr2_bot mp_QHS_percent 0.5
set_instance_parameter_value ddr2_bot mem_tcl_30_fmax 200.0
set_instance_parameter_value ddr2_bot ac_clk_select 90
set_instance_parameter_value ddr2_bot mp_DQSQ_percent 0.65
set_instance_parameter_value ddr2_bot mp_DS_percent 0.6
set_instance_parameter_value ddr2_bot pll_reconfig_ports_en false
set_instance_parameter_value ddr2_bot mem_btype Sequential
set_instance_parameter_value ddr2_bot mp_IS_percent 0.7
set_instance_parameter_value ddr2_bot mem_tcl 5.0
set_instance_parameter_value ddr2_bot mp_DQSS_percent 0.5
set_instance_parameter_value ddr2_bot export_bank_info false
set_instance_parameter_value ddr2_bot mp_DSS_percent 0.6
set_instance_parameter_value ddr2_bot mem_dll_en Yes
set_instance_parameter_value ddr2_bot ac_phase 90
set_instance_parameter_value ddr2_bot mem_if_oct_en false
set_instance_parameter_value ddr2_bot mem_tcl_60_fmax 333.333
set_instance_parameter_value ddr2_bot mp_DSH_percent 0.6
set_instance_parameter_value ddr2_bot mem_if_dqsn_en false
set_instance_parameter_value ddr2_bot enable_mp_calibration true
set_instance_parameter_value ddr2_bot mp_IH_percent 0.6
set_instance_parameter_value ddr2_bot mem_tcl_15_fmax 533.0
set_instance_parameter_value ddr2_bot dll_external false
set_instance_parameter_value ddr2_bot mem_bl 4
set_instance_parameter_value ddr2_bot mp_WLS_percent 0.7
set_instance_parameter_value ddr2_bot mem_tcl_50_fmax 333.333
set_instance_parameter_value ddr2_bot mp_DQSCK_percent 0.5
set_instance_parameter_value ddr2_bot mem_tcl_25_fmax 533.0
set_instance_parameter_value ddr2_bot mem_tcl_20_fmax 533.0
set_instance_parameter_value ddr2_bot cfg_reorder_data true
set_instance_parameter_value ddr2_bot ctl_ecc_en false
set_instance_parameter_value ddr2_bot ctl_hrb_en false
set_instance_parameter_value ddr2_bot ref_clk_source clk_125
set_instance_parameter_value ddr2_bot cfg_data_reordering_type INTER_BANK
set_instance_parameter_value ddr2_bot ctl_powerdn_en false
set_instance_parameter_value ddr2_bot multicast_wr_en false
set_instance_parameter_value ddr2_bot auto_powerdn_cycles 0
set_instance_parameter_value ddr2_bot ctl_self_refresh_en false
set_instance_parameter_value ddr2_bot cfg_starve_limit 10
set_instance_parameter_value ddr2_bot ctl_latency 0
set_instance_parameter_value ddr2_bot tool_context SOPC_BUILDER
set_instance_parameter_value ddr2_bot mem_addr_mapping CHIP_ROW_BANK_COL
set_instance_parameter_value ddr2_bot burst_merge_en false
set_instance_parameter_value ddr2_bot user_refresh_en false
set_instance_parameter_value ddr2_bot qsys_mode true
set_instance_parameter_value ddr2_bot clk_source_sharing_en false
set_instance_parameter_value ddr2_bot ctl_lookahead_depth 4
set_instance_parameter_value ddr2_bot ctl_autopch_en false
set_instance_parameter_value ddr2_bot ctl_dynamic_bank_allocation false
set_instance_parameter_value ddr2_bot ctl_dynamic_bank_num 4
set_instance_parameter_value ddr2_bot local_if_type_avalon true
set_instance_parameter_value ddr2_bot csr_en false
set_instance_parameter_value ddr2_bot ctl_auto_correct_en false
set_instance_parameter_value ddr2_bot auto_powerdn_en false
set_instance_parameter_value ddr2_bot phy_if_type_afi true
set_instance_parameter_value ddr2_bot controller_type ngv110_ctl
set_instance_parameter_value ddr2_bot max_local_size 4
set_instance_parameter_value ddr2_bot mem_srtr Normal
set_instance_parameter_value ddr2_bot mem_mpr_loc {Predefined Pattern}
set_instance_parameter_value ddr2_bot dss_tinit_rst_us 200.0
set_instance_parameter_value ddr2_bot mem_tcl_90_fmax 400.0
set_instance_parameter_value ddr2_bot mem_rtt_wr {Dynamic ODT off}
set_instance_parameter_value ddr2_bot mem_tcl_100_fmax 400.0
set_instance_parameter_value ddr2_bot mem_pasr {Full Array}
set_instance_parameter_value ddr2_bot mem_asrm {Manual SR Reference (SRT)}
set_instance_parameter_value ddr2_bot mem_mpr_oper {Predefined Pattern}
set_instance_parameter_value ddr2_bot mem_tcl_80_fmax 400.0
set_instance_parameter_value ddr2_bot mem_drv_impedance RZQ/7
set_instance_parameter_value ddr2_bot mem_rtt_nom {ODT Disabled}
set_instance_parameter_value ddr2_bot mem_tcl_70_fmax 400.0
set_instance_parameter_value ddr2_bot mem_wtcl 5.0
set_instance_parameter_value ddr2_bot mem_dll_pch {Fast Exit}
set_instance_parameter_value ddr2_bot mem_atcl Disabled
set_instance_parameter_value ddr2_bot board_settings_valid true
set_instance_parameter_value ddr2_bot t_IH 0.4
set_instance_parameter_value ddr2_bot board_intra_DQS_group_skew 0.02
set_instance_parameter_value ddr2_bot isi_DQS 0.0
set_instance_parameter_value ddr2_bot addr_cmd_slew_rate 1.0
set_instance_parameter_value ddr2_bot board_tpd_inter_DIMM 0.05
set_instance_parameter_value ddr2_bot board_addresscmd_CK_skew 0.0
set_instance_parameter_value ddr2_bot t_DS_calculated 0.300
set_instance_parameter_value ddr2_bot isi_addresscmd_hold 0.0
set_instance_parameter_value ddr2_bot t_IS 0.4
set_instance_parameter_value ddr2_bot restore_default_toggle false
set_instance_parameter_value ddr2_bot dqs_dqsn_slew_rate 2.0
set_instance_parameter_value ddr2_bot dq_slew_rate 1.0
set_instance_parameter_value ddr2_bot board_inter_DQS_group_skew 0.02
set_instance_parameter_value ddr2_bot isi_addresscmd_setup 0.0
set_instance_parameter_value ddr2_bot board_minCK_DQS_skew -0.01
set_instance_parameter_value ddr2_bot t_IS_calculated 0.400
set_instance_parameter_value ddr2_bot num_slots_or_devices 1
set_instance_parameter_value ddr2_bot board_maxCK_DQS_skew 0.01
set_instance_parameter_value ddr2_bot board_skew_ps 20
set_instance_parameter_value ddr2_bot t_DH 0.3
set_instance_parameter_value ddr2_bot ck_ckn_slew_rate 2.0
set_instance_parameter_value ddr2_bot isi_DQ 0.0
set_instance_parameter_value ddr2_bot t_IH_calculated 0.400
set_instance_parameter_value ddr2_bot t_DH_calculated 0.300
set_instance_parameter_value ddr2_bot t_DS 0.3

add_instance ddr2_bot_clock_bridge altera_avalon_mm_clock_crossing_bridge 13.0
set_instance_parameter_value ddr2_bot_clock_bridge DATA_WIDTH 64
set_instance_parameter_value ddr2_bot_clock_bridge ADDRESS_WIDTH 27
set_instance_parameter_value ddr2_bot_clock_bridge MAX_BURST_SIZE 1
set_instance_parameter_value ddr2_bot_clock_bridge COMMAND_FIFO_DEPTH 8
set_instance_parameter_value ddr2_bot_clock_bridge RESPONSE_FIFO_DEPTH 64
set_instance_parameter_value ddr2_bot_clock_bridge MASTER_SYNC_DEPTH 3
set_instance_parameter_value ddr2_bot_clock_bridge SLAVE_SYNC_DEPTH 3

add_instance sysclk_bot altera_clock_bridge 13.0
set_instance_parameter_value sysclk_bot DERIVED_CLOCK_RATE 153850000
set_instance_parameter_value sysclk_bot EXPLICIT_CLOCK_RATE 0

add_instance dma_0 altera_avalon_dma 13.0.1
set_instance_parameter_value dma_0 allowByteTransactions true
set_instance_parameter_value dma_0 allowDoubleWordTransactions true
set_instance_parameter_value dma_0 allowHalfWordTransactions true
set_instance_parameter_value dma_0 allowQuadWordTransactions true
set_instance_parameter_value dma_0 burstEnable false
set_instance_parameter_value dma_0 fifoDepth 64
set_instance_parameter_value dma_0 maxBurstSize 8
set_instance_parameter_value dma_0 minimumDmaTransactionRegisterWidth 32

# connections
add_connection clk.clk fir_dma.clock clock
add_connection clk.clk pll.inclk_interface clock
add_connection clk_125.clk ddr2_bot.refclk clock
add_connection clk_125.clk ddr2_top.refclk clock
add_connection ddr2_bot.sysclk ddr2_bot_clock_bridge.m0_clk clock
add_connection ddr2_bot.sysclk sysclk_bot.in_clk clock
add_connection ddr2_top.sysclk ddr2_top_clock_bridge.m0_clk clock
add_connection ddr2_top.sysclk sysclk_top.in_clk clock
add_connection pll.c0 c0.in_clk clock
add_connection pll.c0 cpu.clk clock
add_connection pll.c0 ddr2_bot_clock_bridge.s0_clk clock
add_connection pll.c0 ddr2_top_clock_bridge.s0_clk clock
add_connection pll.c0 dma_0.clk clock
add_connection pll.c0 ext_flash.clk clock
add_connection pll.c0 flash_ssram_pipeline_bridge.clk clock
add_connection pll.c0 flash_ssram_tristate_bridge_bridge_0.clk clock
add_connection pll.c0 flash_ssram_tristate_bridge_pinSharer_0.clk clock
add_connection pll.c0 slow_peripheral_bridge.s0_clk clock
add_connection pll.c0 ssram.clk clock
add_connection pll.c2 button_pio.clk clock
add_connection pll.c2 c2.in_clk clock
add_connection pll.c2 high_res_timer.clk clock
add_connection pll.c2 jtag_uart.clk clock
add_connection pll.c2 lcd_display.clk clock
add_connection pll.c2 led_pio.clk clock
add_connection pll.c2 performance_counter.clk clock
add_connection pll.c2 seven_seg_pio.clk clock
add_connection pll.c2 slow_peripheral_bridge.m0_clk clock
add_connection pll.c2 sys_clk_timer.clk clock
add_connection pll.c2 sysid.clk clock
add_connection clk.clk_reset button_pio.reset reset
add_connection clk.clk_reset cpu.reset_n reset
add_connection clk.clk_reset ddr2_bot.soft_reset_n reset
add_connection clk.clk_reset ddr2_bot_clock_bridge.m0_reset reset
add_connection clk.clk_reset ddr2_bot_clock_bridge.s0_reset reset
add_connection clk.clk_reset ddr2_top.soft_reset_n reset
add_connection clk.clk_reset ddr2_top_clock_bridge.m0_reset reset
add_connection clk.clk_reset ddr2_top_clock_bridge.s0_reset reset
add_connection clk.clk_reset dma_0.reset reset
add_connection clk.clk_reset ext_flash.reset reset
add_connection clk.clk_reset fir_dma.clock_reset reset
add_connection clk.clk_reset flash_ssram_pipeline_bridge.reset reset
add_connection clk.clk_reset flash_ssram_tristate_bridge_bridge_0.reset reset
add_connection clk.clk_reset flash_ssram_tristate_bridge_pinSharer_0.reset reset
add_connection clk.clk_reset high_res_timer.reset reset
add_connection clk.clk_reset jtag_uart.reset reset
add_connection clk.clk_reset lcd_display.reset reset
add_connection clk.clk_reset led_pio.reset reset
add_connection clk.clk_reset performance_counter.reset reset
add_connection clk.clk_reset pll.inclk_interface_reset reset
add_connection clk.clk_reset seven_seg_pio.reset reset
add_connection clk.clk_reset slow_peripheral_bridge.m0_reset reset
add_connection clk.clk_reset slow_peripheral_bridge.s0_reset reset
add_connection clk.clk_reset ssram.reset reset
add_connection clk.clk_reset sys_clk_timer.reset reset
add_connection clk.clk_reset sysid.reset reset
add_connection clk_125.clk_reset button_pio.reset reset
add_connection clk_125.clk_reset cpu.reset_n reset
add_connection clk_125.clk_reset ddr2_bot.soft_reset_n reset
add_connection clk_125.clk_reset ddr2_bot_clock_bridge.m0_reset reset
add_connection clk_125.clk_reset ddr2_bot_clock_bridge.s0_reset reset
add_connection clk_125.clk_reset ddr2_top.soft_reset_n reset
add_connection clk_125.clk_reset ddr2_top_clock_bridge.m0_reset reset
add_connection clk_125.clk_reset ddr2_top_clock_bridge.s0_reset reset
add_connection clk_125.clk_reset dma_0.reset reset
add_connection clk_125.clk_reset ext_flash.reset reset
add_connection clk_125.clk_reset fir_dma.clock_reset reset
add_connection clk_125.clk_reset flash_ssram_pipeline_bridge.reset reset
add_connection clk_125.clk_reset flash_ssram_tristate_bridge_bridge_0.reset reset
add_connection clk_125.clk_reset flash_ssram_tristate_bridge_pinSharer_0.reset reset
add_connection clk_125.clk_reset high_res_timer.reset reset
add_connection clk_125.clk_reset jtag_uart.reset reset
add_connection clk_125.clk_reset lcd_display.reset reset
add_connection clk_125.clk_reset led_pio.reset reset
add_connection clk_125.clk_reset performance_counter.reset reset
add_connection clk_125.clk_reset pll.inclk_interface_reset reset
add_connection clk_125.clk_reset seven_seg_pio.reset reset
add_connection clk_125.clk_reset slow_peripheral_bridge.m0_reset reset
add_connection clk_125.clk_reset slow_peripheral_bridge.s0_reset reset
add_connection clk_125.clk_reset ssram.reset reset
add_connection clk_125.clk_reset sys_clk_timer.reset reset
add_connection clk_125.clk_reset sysid.reset reset
add_connection cpu.jtag_debug_module_reset button_pio.reset reset
add_connection cpu.jtag_debug_module_reset cpu.reset_n reset
add_connection cpu.jtag_debug_module_reset ddr2_bot.global_reset_n reset
add_connection cpu.jtag_debug_module_reset ddr2_bot.soft_reset_n reset
add_connection cpu.jtag_debug_module_reset ddr2_bot_clock_bridge.m0_reset reset
add_connection cpu.jtag_debug_module_reset ddr2_bot_clock_bridge.s0_reset reset
add_connection cpu.jtag_debug_module_reset ddr2_top.global_reset_n reset
add_connection cpu.jtag_debug_module_reset ddr2_top.soft_reset_n reset
add_connection cpu.jtag_debug_module_reset ddr2_top_clock_bridge.m0_reset reset
add_connection cpu.jtag_debug_module_reset ddr2_top_clock_bridge.s0_reset reset
add_connection cpu.jtag_debug_module_reset dma_0.reset reset
add_connection cpu.jtag_debug_module_reset ext_flash.reset reset
add_connection cpu.jtag_debug_module_reset fir_dma.clock_reset reset
add_connection cpu.jtag_debug_module_reset flash_ssram_pipeline_bridge.reset reset
add_connection cpu.jtag_debug_module_reset flash_ssram_tristate_bridge_bridge_0.reset reset
add_connection cpu.jtag_debug_module_reset flash_ssram_tristate_bridge_pinSharer_0.reset reset
add_connection cpu.jtag_debug_module_reset high_res_timer.reset reset
add_connection cpu.jtag_debug_module_reset jtag_uart.reset reset
add_connection cpu.jtag_debug_module_reset lcd_display.reset reset
add_connection cpu.jtag_debug_module_reset led_pio.reset reset
add_connection cpu.jtag_debug_module_reset performance_counter.reset reset
add_connection cpu.jtag_debug_module_reset pll.inclk_interface_reset reset
add_connection cpu.jtag_debug_module_reset seven_seg_pio.reset reset
add_connection cpu.jtag_debug_module_reset slow_peripheral_bridge.m0_reset reset
add_connection cpu.jtag_debug_module_reset slow_peripheral_bridge.s0_reset reset
add_connection cpu.jtag_debug_module_reset ssram.reset reset
add_connection cpu.jtag_debug_module_reset sys_clk_timer.reset reset
add_connection cpu.jtag_debug_module_reset sysid.reset reset
add_connection ddr2_bot.reset_request_n button_pio.reset reset
add_connection ddr2_bot.reset_request_n cpu.reset_n reset
add_connection ddr2_bot.reset_request_n ddr2_bot.soft_reset_n reset
add_connection ddr2_bot.reset_request_n ddr2_bot_clock_bridge.m0_reset reset
add_connection ddr2_bot.reset_request_n ddr2_bot_clock_bridge.s0_reset reset
add_connection ddr2_bot.reset_request_n ddr2_top.soft_reset_n reset
add_connection ddr2_bot.reset_request_n ddr2_top_clock_bridge.m0_reset reset
add_connection ddr2_bot.reset_request_n ddr2_top_clock_bridge.s0_reset reset
add_connection ddr2_bot.reset_request_n dma_0.reset reset
add_connection ddr2_bot.reset_request_n ext_flash.reset reset
add_connection ddr2_bot.reset_request_n fir_dma.clock_reset reset
add_connection ddr2_bot.reset_request_n flash_ssram_pipeline_bridge.reset reset
add_connection ddr2_bot.reset_request_n flash_ssram_tristate_bridge_bridge_0.reset reset
add_connection ddr2_bot.reset_request_n flash_ssram_tristate_bridge_pinSharer_0.reset reset
add_connection ddr2_bot.reset_request_n high_res_timer.reset reset
add_connection ddr2_bot.reset_request_n jtag_uart.reset reset
add_connection ddr2_bot.reset_request_n lcd_display.reset reset
add_connection ddr2_bot.reset_request_n led_pio.reset reset
add_connection ddr2_bot.reset_request_n performance_counter.reset reset
add_connection ddr2_bot.reset_request_n pll.inclk_interface_reset reset
add_connection ddr2_bot.reset_request_n seven_seg_pio.reset reset
add_connection ddr2_bot.reset_request_n slow_peripheral_bridge.m0_reset reset
add_connection ddr2_bot.reset_request_n slow_peripheral_bridge.s0_reset reset
add_connection ddr2_bot.reset_request_n ssram.reset reset
add_connection ddr2_bot.reset_request_n sys_clk_timer.reset reset
add_connection ddr2_bot.reset_request_n sysid.reset reset
add_connection ddr2_top.reset_request_n button_pio.reset reset
add_connection ddr2_top.reset_request_n cpu.reset_n reset
add_connection ddr2_top.reset_request_n ddr2_bot.soft_reset_n reset
add_connection ddr2_top.reset_request_n ddr2_bot_clock_bridge.m0_reset reset
add_connection ddr2_top.reset_request_n ddr2_bot_clock_bridge.s0_reset reset
add_connection ddr2_top.reset_request_n ddr2_top.soft_reset_n reset
add_connection ddr2_top.reset_request_n ddr2_top_clock_bridge.m0_reset reset
add_connection ddr2_top.reset_request_n ddr2_top_clock_bridge.s0_reset reset
add_connection ddr2_top.reset_request_n dma_0.reset reset
add_connection ddr2_top.reset_request_n ext_flash.reset reset
add_connection ddr2_top.reset_request_n fir_dma.clock_reset reset
add_connection ddr2_top.reset_request_n flash_ssram_pipeline_bridge.reset reset
add_connection ddr2_top.reset_request_n flash_ssram_tristate_bridge_bridge_0.reset reset
add_connection ddr2_top.reset_request_n flash_ssram_tristate_bridge_pinSharer_0.reset reset
add_connection ddr2_top.reset_request_n high_res_timer.reset reset
add_connection ddr2_top.reset_request_n jtag_uart.reset reset
add_connection ddr2_top.reset_request_n lcd_display.reset reset
add_connection ddr2_top.reset_request_n led_pio.reset reset
add_connection ddr2_top.reset_request_n performance_counter.reset reset
add_connection ddr2_top.reset_request_n pll.inclk_interface_reset reset
add_connection ddr2_top.reset_request_n seven_seg_pio.reset reset
add_connection ddr2_top.reset_request_n slow_peripheral_bridge.m0_reset reset
add_connection ddr2_top.reset_request_n slow_peripheral_bridge.s0_reset reset
add_connection ddr2_top.reset_request_n ssram.reset reset
add_connection ddr2_top.reset_request_n sys_clk_timer.reset reset
add_connection ddr2_top.reset_request_n sysid.reset reset
add_connection merged_resets.out_reset clk.clk_in_reset reset
add_connection merged_resets.out_reset clk_125.clk_in_reset reset
add_connection cpu.data_master cpu.jtag_debug_module avalon
set_connection_parameter_value cpu.data_master/cpu.jtag_debug_module baseAddress 0x21000800
add_connection cpu.data_master ddr2_bot_clock_bridge.s0 avalon
set_connection_parameter_value cpu.data_master/ddr2_bot_clock_bridge.s0 baseAddress 0x10000000
add_connection cpu.data_master ddr2_top_clock_bridge.s0 avalon
set_connection_parameter_value cpu.data_master/ddr2_top_clock_bridge.s0 baseAddress 0x18000000
add_connection cpu.data_master dma_0.control_port_slave avalon
set_connection_parameter_value cpu.data_master/dma_0.control_port_slave baseAddress 0x21001000
add_connection cpu.data_master flash_ssram_pipeline_bridge.s0 avalon
set_connection_parameter_value cpu.data_master/flash_ssram_pipeline_bridge.s0 baseAddress 0x0000
add_connection cpu.data_master slow_peripheral_bridge.s0 avalon
set_connection_parameter_value cpu.data_master/slow_peripheral_bridge.s0 baseAddress 0x20000000
add_connection cpu.instruction_master cpu.jtag_debug_module avalon
set_connection_parameter_value cpu.instruction_master/cpu.jtag_debug_module baseAddress 0x21000800
add_connection cpu.instruction_master ddr2_top_clock_bridge.s0 avalon
set_connection_parameter_value cpu.instruction_master/ddr2_top_clock_bridge.s0 baseAddress 0x18000000
add_connection cpu.instruction_master flash_ssram_pipeline_bridge.s0 avalon
set_connection_parameter_value cpu.instruction_master/flash_ssram_pipeline_bridge.s0 baseAddress 0x0000
add_connection ddr2_bot_clock_bridge.m0 ddr2_bot.s1 avalon
set_connection_parameter_value ddr2_bot_clock_bridge.m0/ddr2_bot.s1 baseAddress 0x0000
add_connection ddr2_top_clock_bridge.m0 ddr2_top.s1 avalon
set_connection_parameter_value ddr2_top_clock_bridge.m0/ddr2_top.s1 baseAddress 0x0000
add_connection dma_0.read_master ddr2_top_clock_bridge.s0 avalon
set_connection_parameter_value dma_0.read_master/ddr2_top_clock_bridge.s0 baseAddress 0x18000000
add_connection dma_0.write_master ddr2_bot_clock_bridge.s0 avalon
set_connection_parameter_value dma_0.write_master/ddr2_bot_clock_bridge.s0 baseAddress 0x10000000
add_connection fir_dma.read_master flash_ssram_pipeline_bridge.s0 avalon
set_connection_parameter_value fir_dma.read_master/flash_ssram_pipeline_bridge.s0 baseAddress 0x0000
add_connection fir_dma.write_master ddr2_top.s1 avalon
set_connection_parameter_value fir_dma.write_master/ddr2_top.s1 baseAddress 0x0000
add_connection flash_ssram_pipeline_bridge.m0 ext_flash.uas avalon
set_connection_parameter_value flash_ssram_pipeline_bridge.m0/ext_flash.uas baseAddress 0x0000
add_connection flash_ssram_pipeline_bridge.m0 ssram.uas avalon
set_connection_parameter_value flash_ssram_pipeline_bridge.m0/ssram.uas baseAddress 0x04000000
add_connection slow_peripheral_bridge.m0 button_pio.s1 avalon
set_connection_parameter_value slow_peripheral_bridge.m0/button_pio.s1 baseAddress 0x0070
add_connection slow_peripheral_bridge.m0 fir_dma.control avalon
set_connection_parameter_value slow_peripheral_bridge.m0/fir_dma.control baseAddress 0x0360
add_connection slow_peripheral_bridge.m0 high_res_timer.s1 avalon
